# EAGLE board Index Registers - 1.0 (EAGLE 9.6.2), part 1 of 2
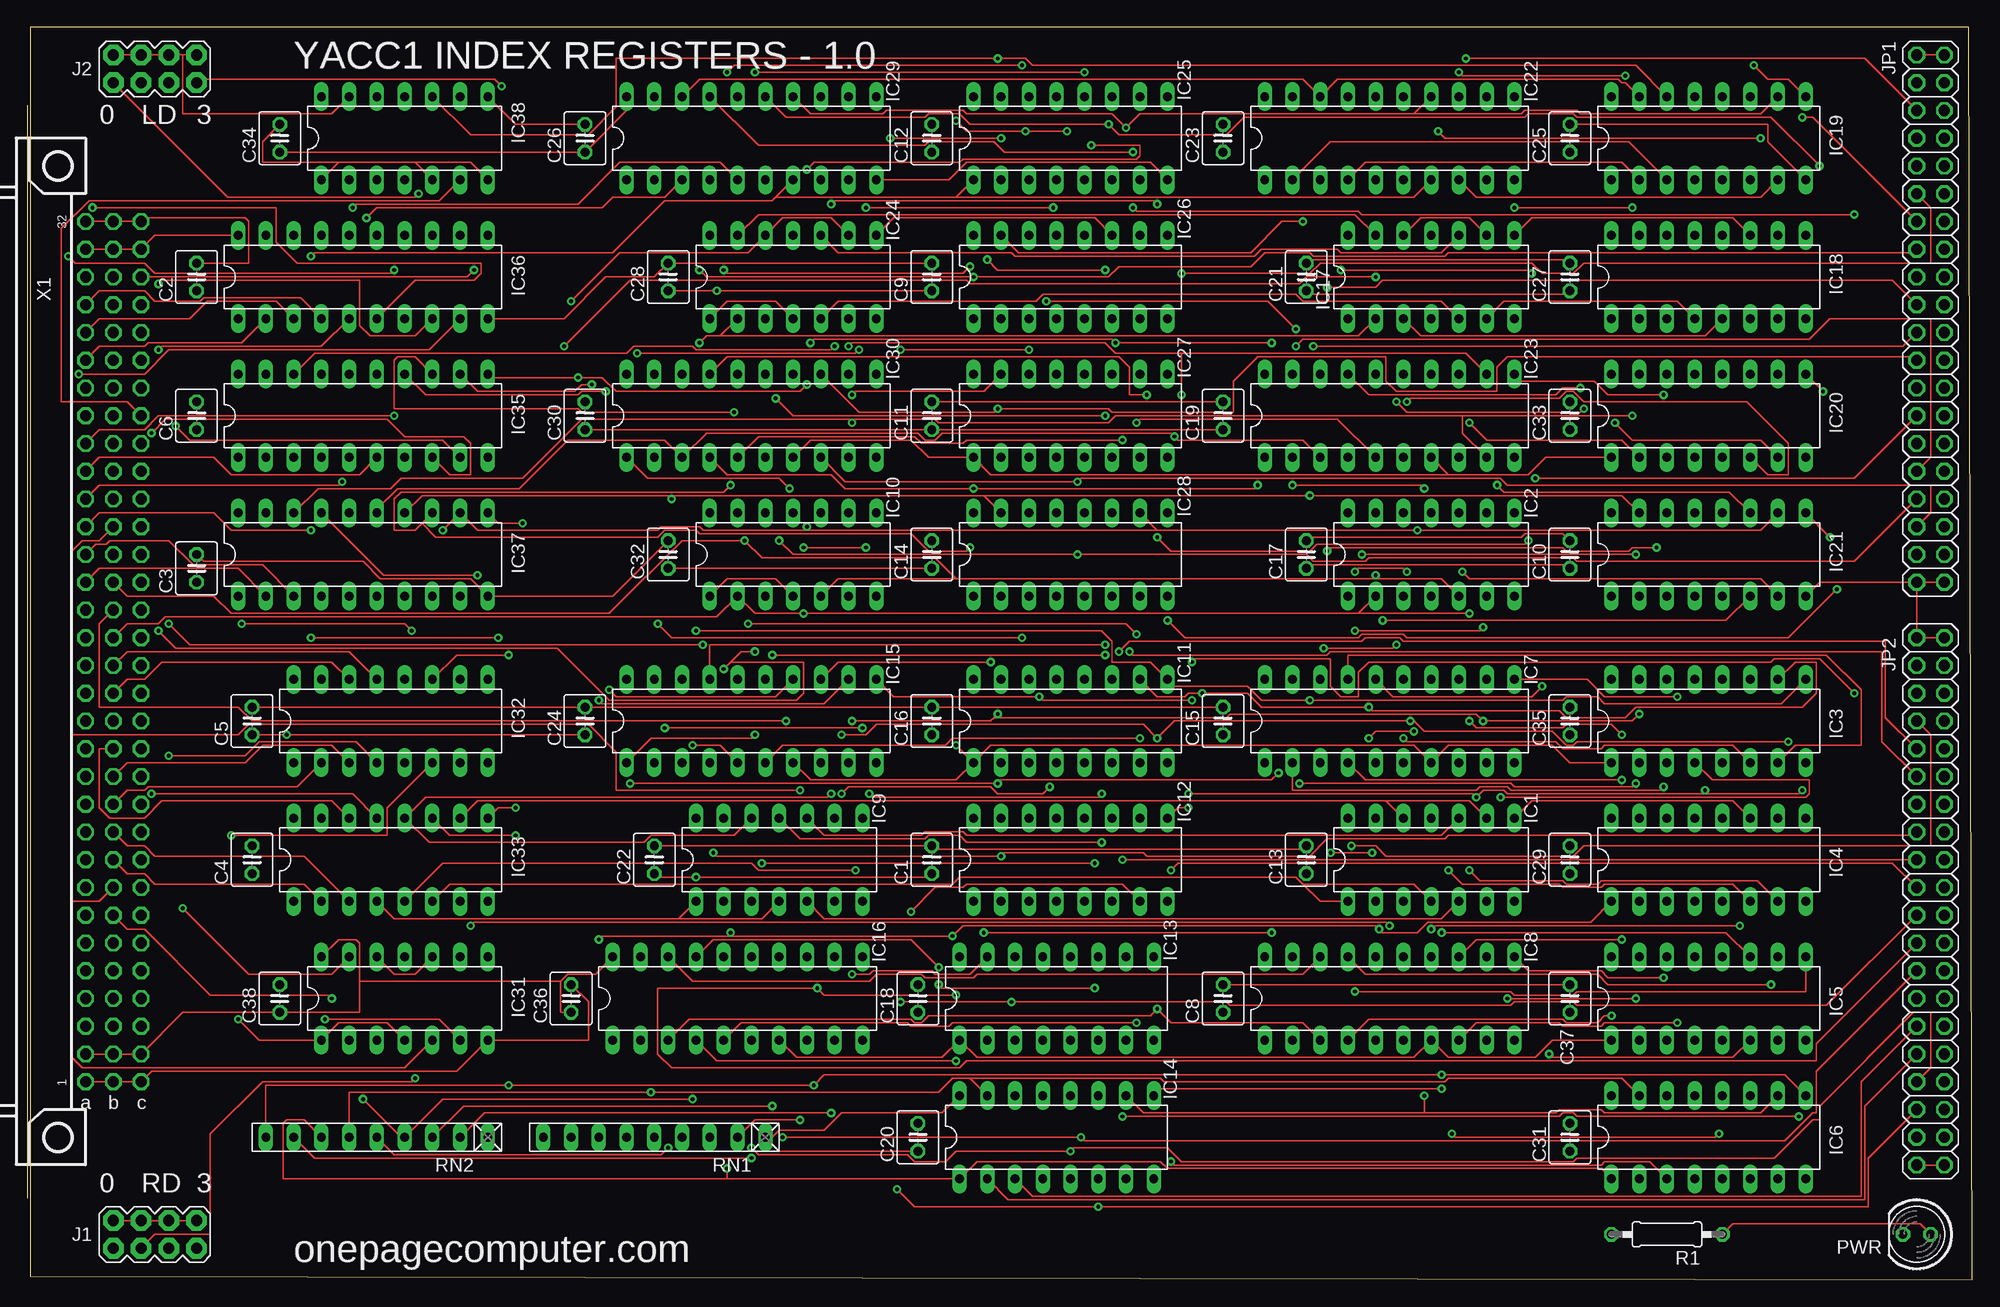
[diagram p9: board, top side]
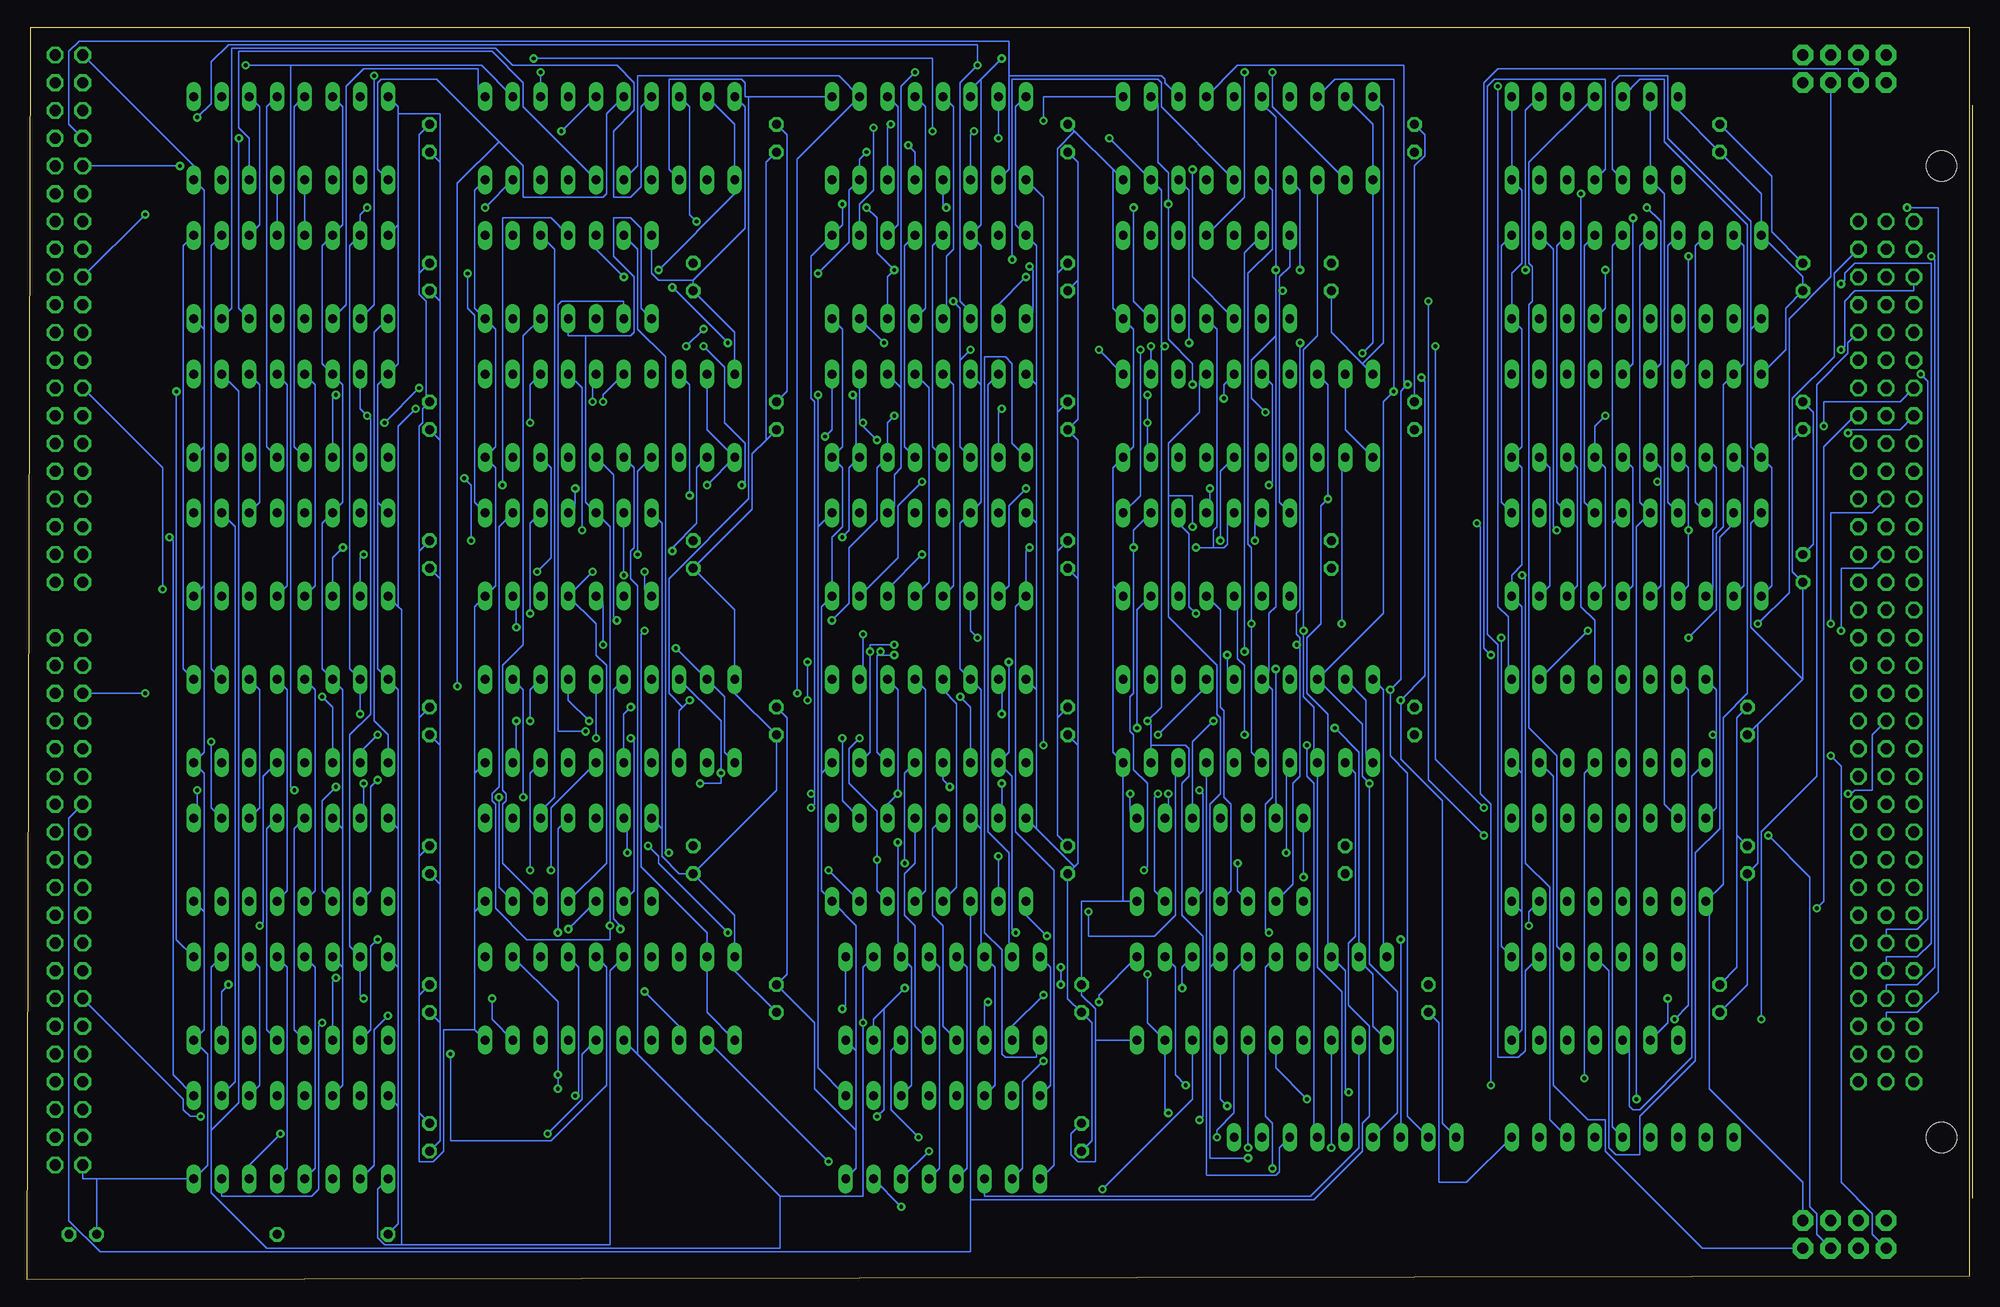
[diagram p10: board, bottom side, seen from below]

Size 177.8 x 114.62 mm. Coordinates in mm from the lower left corner, seen from the top.
Outline: 0,0.33 177.8,0 177.47,114.62 0,114.62 0,0.33
Copper layers (1*16): Top 0.035mm / dielectric 1.5mm / Bottom 0.035mm
Design rules "default": minimum track width 6mil, minimum drill 0.35mm, track to track 6mil, track to pad 6mil, pad to pad 6mil, via to via 6mil, smd to smd 6mil, copper to edge 40mil, drill to drill 6mil, minimum pad ring 10mil, minimum via ring 8mil, stop-mask expansion 4mil, vias tented up to drill 0mil, thermal gap 10mil

## Footprints (pad centres in the part's own frame; a part is rotated, then mirrored left to right if it is on the bottom)
C025-040X050 = drill 0.813 octagon: 1 -1.27,0; 2 1.27,0
DIL14 = drill 0.813 long: 1 -7.62,-3.81; 2 -5.08,-3.81; 3 -2.54,-3.81; 4 0,-3.81; 5 2.54,-3.81; 6 5.08,-3.81; 7 7.62,-3.81; 8 7.62,3.81; 9 5.08,3.81; 10 2.54,3.81; 11 0,3.81; 12 -2.54,3.81; 13 -5.08,3.81; 14 -7.62,3.81
DIL16 = drill 0.813 long: 1 -8.89,-3.81; 2 -6.35,-3.81; 3 -3.81,-3.81; 4 -1.27,-3.81; 5 1.27,-3.81; 6 3.81,-3.81; 7 6.35,-3.81; 8 8.89,-3.81; 9 8.89,3.81; 10 6.35,3.81; 11 3.81,3.81; 12 1.27,3.81; 13 -1.27,3.81; 14 -3.81,3.81; 15 -6.35,3.81; 16 -8.89,3.81
DIL20 = drill 0.813 long: 1 -11.43,-3.81; 2 -8.89,-3.81; 3 -6.35,-3.81; 4 -3.81,-3.81; 5 -1.27,-3.81; 6 1.27,-3.81; 7 3.81,-3.81; 8 6.35,-3.81; 9 8.89,-3.81; 10 11.43,-3.81; 11 11.43,3.81; 12 8.89,3.81; 13 6.35,3.81; 14 3.81,3.81; 15 1.27,3.81; 16 -1.27,3.81; 17 -3.81,3.81; 18 -6.35,3.81; 19 -8.89,3.81; 20 -11.43,3.81
2X4 = drill 1.016 pad 1.88 octagon: 1 -3.81,-1.27; 2 -3.81,1.27; 3 -1.27,-1.27; 4 -1.27,1.27; 5 1.27,-1.27; 6 1.27,1.27; 7 3.81,-1.27; 8 3.81,1.27
2X20 = drill 1.016 octagon: 1 -24.13,-1.27; 2 -24.13,1.27; 3 -21.59,-1.27; 4 -21.59,1.27; 5 -19.05,-1.27; 6 -19.05,1.27; 7 -16.51,-1.27; 8 -16.51,1.27; 9 -13.97,-1.27; 10 -13.97,1.27; 11 -11.43,-1.27; 12 -11.43,1.27; 13 -8.89,-1.27; 14 -8.89,1.27; 15 -6.35,-1.27; 16 -6.35,1.27; 17 -3.81,-1.27; 18 -3.81,1.27; 19 -1.27,-1.27; 20 -1.27,1.27; 21 1.27,-1.27; 22 1.27,1.27; 23 3.81,-1.27; 24 3.81,1.27; 25 6.35,-1.27; 26 6.35,1.27; 27 8.89,-1.27; 28 8.89,1.27; 29 11.43,-1.27; 30 11.43,1.27; 31 13.97,-1.27; 32 13.97,1.27; 33 16.51,-1.27; 34 16.51,1.27; 35 19.05,-1.27; 36 19.05,1.27; 37 21.59,-1.27; 38 21.59,1.27; 39 24.13,-1.27; 40 24.13,1.27
LED5MM = drill 0.813 octagon: A -1.27,0; K 1.27,0
0207/10 = drill 0.813 octagon: 1 -5.08,0; 2 5.08,0
RN-9 = drill 0.813 long: 1 -10.16,0; 2 -7.62,0; 3 -5.08,0; 4 -2.54,0; 5 0,0; 6 2.54,0; 7 5.08,0; 8 7.62,0; 9 10.16,0
FABC96R = drill 1.016 octagon: A1 -2.54,39.37; A2 -2.54,36.83; A3 -2.54,34.29; A4 -2.54,31.75; A5 -2.54,29.21; A6 -2.54,26.67; A7 -2.54,24.13; A8 -2.54,21.59; A9 -2.54,19.05; A10 -2.54,16.51; A11 -2.54,13.97; A12 -2.54,11.43; A13 -2.54,8.89; A14 -2.54,6.35; A15 -2.54,3.81; A16 -2.54,1.27; A17 -2.54,-1.27; A18 -2.54,-3.81; A19 -2.54,-6.35; A20 -2.54,-8.89; A21 -2.54,-11.43; A22 -2.54,-13.97; A23 -2.54,-16.51; A24 -2.54,-19.05; A25 -2.54,-21.59; A26 -2.54,-24.13; A27 -2.54,-26.67; A28 -2.54,-29.21; A29 -2.54,-31.75; A30 -2.54,-34.29; A31 -2.54,-36.83; A32 -2.54,-39.37; B1 -5.08,39.37; B2 -5.08,36.83; B3 -5.08,34.29; B4 -5.08,31.75; B5 -5.08,29.21; B6 -5.08,26.67; B7 -5.08,24.13; B8 -5.08,21.59; B9 -5.08,19.05; B10 -5.08,16.51; B11 -5.08,13.97; B12 -5.08,11.43; B13 -5.08,8.89; B14 -5.08,6.35; B15 -5.08,3.81; B16 -5.08,1.27; B17 -5.08,-1.27; B18 -5.08,-3.81; B19 -5.08,-6.35; B20 -5.08,-8.89; B21 -5.08,-11.43; B22 -5.08,-13.97; B23 -5.08,-16.51; B24 -5.08,-19.05; B25 -5.08,-21.59; B26 -5.08,-24.13; B27 -5.08,-26.67; B28 -5.08,-29.21; B29 -5.08,-31.75; B30 -5.08,-34.29; B31 -5.08,-36.83; B32 -5.08,-39.37; C1 -7.62,39.37; C2 -7.62,36.83; C3 -7.62,34.29; C4 -7.62,31.75; C5 -7.62,29.21; C6 -7.62,26.67; C7 -7.62,24.13; C8 -7.62,21.59; C9 -7.62,19.05; C10 -7.62,16.51; C11 -7.62,13.97; C12 -7.62,11.43; C13 -7.62,8.89; C14 -7.62,6.35; C15 -7.62,3.81; C16 -7.62,1.27; C17 -7.62,-1.27; C18 -7.62,-3.81; C19 -7.62,-6.35; C20 -7.62,-8.89; C21 -7.62,-11.43; C22 -7.62,-13.97; C23 -7.62,-16.51; C24 -7.62,-19.05; C25 -7.62,-21.59; C26 -7.62,-24.13; C27 -7.62,-26.67; C28 -7.62,-29.21; C29 -7.62,-31.75; C30 -7.62,-34.29; C31 -7.62,-36.83; C32 -7.62,-39.37 | hole 2.794: 0,-44.456; 0,44.456

## Placement (x,y rotation side)
C1  0.1  [C025-040X050]  82.55,38.43 90 top
C2  0.1  [C025-040X050]  15.24,91.77 90 top
C3  0.1  [C025-040X050]  15.24,65.1 90 top
C4  0.1  [C025-040X050]  20.32,38.43 90 top
C5  0.1  [C025-040X050]  20.32,51.13 90 top
C6  0.1  [C025-040X050]  15.24,79.07 90 top
C8  0.1  [C025-040X050]  109.22,25.73 90 top
C9  0.1  [C025-040X050]  82.55,91.77 90 top
C10  0.1  [C025-040X050]  140.97,66.37 90 top
C11  0.1  [C025-040X050]  82.55,79.07 90 top
C12  0.1  [C025-040X050]  82.55,104.47 90 top
C13  0.1  [C025-040X050]  116.84,38.43 90 top
C14  0.1  [C025-040X050]  82.55,66.37 90 top
C15  0.1  [C025-040X050]  109.22,51.13 90 top
C16  0.1  [C025-040X050]  82.55,51.13 90 top
C17  0.1  [C025-040X050]  116.84,66.37 90 top
C18  0.1  [C025-040X050]  81.28,25.73 90 top
C19  0.1  [C025-040X050]  109.22,79.07 90 top
C20  0.1  [C025-040X050]  81.28,13.03 90 top
C21  0.1  [C025-040X050]  116.84,91.77 90 top
C22  0.1  [C025-040X050]  57.15,38.43 90 top
C23  0.1  [C025-040X050]  109.22,104.47 90 top
C24  0.1  [C025-040X050]  50.8,51.13 90 top
C25  0.1  [C025-040X050]  140.97,104.47 90 top
C26  0.1  [C025-040X050]  50.8,104.47 90 top
C27  0.1  [C025-040X050]  140.97,91.77 90 top
C28  0.1  [C025-040X050]  58.42,91.77 90 top
C29  0.1  [C025-040X050]  140.97,38.43 90 top
C30  0.1  [C025-040X050]  50.8,79.07 90 top
C31  0.1  [C025-040X050]  140.97,13.03 90 top
C32  0.1  [C025-040X050]  58.42,66.37 90 top
C33  0.1  [C025-040X050]  140.97,79.07 90 top
C34  0.1  [C025-040X050]  22.86,104.47 90 top
C35  0.1  [C025-040X050]  140.97,51.13 90 top
C36  0.1  [C025-040X050]  49.53,25.73 90 top
C37  0.1  [C025-040X050]  140.97,25.73 90 top
C38  0.1  [C025-040X050]  22.86,25.73 90 top
IC1  74LS32N  [DIL14]  128.27,38.43 0 top
IC2  74LS32N  [DIL14]  128.27,66.37 0 top
IC3  74LS192N  [DIL16]  153.67,51.13 0 top
IC4  74LS192N  [DIL16]  153.67,38.43 0 top
IC5  74LS192N  [DIL16]  153.67,25.73 0 top
IC6  74LS192N  [DIL16]  153.67,13.03 0 top
IC7  74LS244N  [DIL20]  124.46,51.13 0 top
IC8  74LS244N  [DIL20]  124.46,25.73 0 top
IC9  74LS32N  [DIL14]  68.58,38.43 0 top
IC10  74LS32N  [DIL14]  69.85,66.37 0 top
IC11  74LS192N  [DIL16]  95.25,51.13 0 top
IC12  74LS192N  [DIL16]  95.25,38.43 0 top
IC13  74LS192N  [DIL16]  93.98,25.73 0 top
IC14  74LS192N  [DIL16]  93.98,13.03 0 top
IC15  74LS244N  [DIL20]  66.04,51.13 0 top
IC16  74LS244N  [DIL20]  64.77,25.73 0 top
IC17  74LS32N  [DIL14]  128.27,91.77 0 top
IC18  74LS192N  [DIL16]  153.67,91.77 0 top
IC19  74LS192N  [DIL16]  153.67,104.47 0 top
IC20  74LS192N  [DIL16]  153.67,79.07 0 top
IC21  74LS192N  [DIL16]  153.67,66.37 0 top
IC22  74LS244N  [DIL20]  124.46,104.47 0 top
IC23  74LS244N  [DIL20]  124.46,79.07 0 top
IC24  74LS32N  [DIL14]  69.85,91.77 0 top
IC25  74LS192N  [DIL16]  95.25,104.47 0 top
IC26  74LS192N  [DIL16]  95.25,91.77 0 top
IC27  74LS192N  [DIL16]  95.25,79.07 0 top
IC28  74LS192N  [DIL16]  95.25,66.37 0 top
IC29  74LS244N  [DIL20]  66.04,104.47 0 top
IC30  74LS244N  [DIL20]  66.04,79.07 0 top
IC31  74LS32N  [DIL14]  34.29,25.73 0 top
IC32  74LS139N  [DIL16]  33.02,51.13 0 top
IC33  74LS139N  [DIL16]  33.02,38.43 0 top
IC35  74LS245N  [DIL20]  30.48,79.07 0 top
IC36  74LS245N  [DIL20]  30.48,91.77 0 top
IC37  74LS245N  [DIL20]  30.48,66.37 0 top
IC38  74LS266N  [DIL14]  34.29,104.47 0 top
J1  [2X4]  11.43,4.14 0 top
J2  [2X4]  11.43,110.82 0 top
JP1  [2X20]  173.99,87.96 270 top
JP2  [2X20]  173.99,34.62 270 top
PWR  [LED5MM]  172.72,4.14 180 top
R1  330  [0207/10]  149.86,4.14 180 top
RN1  10k  [RN-9]  57.15,13.03 180 top
RN2  10k  [RN-9]  31.75,13.03 180 top
X1  FABC96R  [FABC96R]  2.54,57.48 180 top

## Tracks (layer width: path | path; a pad name or v marks a point on that pad's centre or on a via)
-BUS-EN  (via drill 0.35)
  Top 0.152: IC31.4 32.7,23.51 28.26,23.51 IC31.1 20.95,21.92 v19.05,23.82
  Bottom 0.152: X1.C28 11.11,85.74 11.11,84.78 13.97,81.93 13.97,46.05 19.05,40.97 v19.05,23.82
-HL-SWAP  (via drill 0.35)
  Top 0.152: IC31.13 27.62,27.95 20,27.95 v13.97,33.98 | IC38.6 37.47,98.75 5.4,98.75 2.86,96.22 2.86,80.34 8.89,80.34 X1.C25
  Bottom 0.152: v13.97,33.98 13.34,34.62 13.34,76.21 10.48,79.07 X1.C25
-LDSEL
  Top 0.152: J2.2 J2.4 J2.6 13.97,112.09 | 13.97,112.09 J2.8 | 13.97,112.09 13.97,106.69 27.62,106.69 IC38.13
  Bottom 0.152: IC33.15 27.94,43.51 27.94,99.39 IC38.2 IC38.13
-R0-LDSEL  (via drill 0.35)
  Top 0.152: IC9.12 64.45,40.65 56.83,40.65 56.2,40.02 36.51,40.02 IC33.12 36.2,44.14 73.03,44.14 v73.34,44.46
  Bottom 0.152: IC9.9 73.34,42.56 v73.34,44.46
-R0-RDSEL
  Top 0.152: IC10.1 63.82,64.15 68.26,64.15 IC10.4 | IC33.4 33.34,33.03 59.37,33.03 | IC9.1 59.37,33.03 | IC9.4 66.99,33.03 59.37,33.03
  Bottom 0.152: IC10.4 68.58,61.29 68.58,52.4 68.26,52.08 68.26,44.14 67.63,43.51 67.63,35.57 IC9.4
-R1-LDSEL  (via drill 0.35)
  Top 0.152: IC33.11 38.42,40.65 v44.45,40.65 | v49.53,89.55 53.98,93.99 65.72,93.99 IC24.12 68.9,97.17 73.34,97.17 IC24.9
  Bottom 0.152: v44.45,40.65 49.53,45.73 v49.53,89.55
-R1-RDSEL  (via drill 0.35)
  Top 0.152: IC24.1 63.82,89.55 68.26,89.55 IC24.4 | IC33.5 37.78,38.11 66.04,38.11 66.67,37.48 v75.56,37.48 | v76.52,67 v70.8,67
  Bottom 0.152: IC10.12 67.94,69.55 67.94,67.32 68.26,67 69.22,67 | 69.22,67 69.22,68.59 68.9,68.91 68.9,87.01 IC24.4 | v75.56,37.48 75.25,37.8 75.25,45.41 76.52,46.68 76.52,49.86 76.83,50.18 76.83,53.35 76.52,53.67 v76.52,67 76.52,68.59 IC10.9 | v70.8,67 69.22,67
-R2-LDSEL
  Top 0.152: IC33.10 40.96,43.83 124.14,43.83 | IC1.12 124.14,43.83 | IC1.9 131.76,43.83 124.14,43.83
-R2-RDSEL  (via drill 0.35)
  Top 0.152: v121.28,64.78 121.6,65.1 125.73,65.1 v126.05,64.78 | IC33.6 38.42,36.21 84.45,36.21 85.09,36.84 115.89,36.84 116.52,36.21 | 116.52,36.21 118.11,34.62 IC1.1 | IC1.4 126.68,36.21 116.52,36.21
  Bottom 0.152: IC2.1 121.28,63.2 v121.28,64.78 | v126.05,64.78 IC2.4 125.73,60.02 125.73,57.16 124.78,56.21 124.78,38.11 IC1.4
-R3-LDSEL  (via drill 0.35)
  Top 0.152: IC33.9 42.86,43.19 v44.45,43.19 | v48.9,85.42 54.93,91.45 85.72,91.45 86.04,91.14 116.2,91.14 116.84,91.77 v123.19,91.77 | IC17.9 131.76,97.17 127.32,97.17 IC17.12
  Bottom 0.152: v44.45,43.19 48.9,47.64 v48.9,85.42 | v123.19,91.77 125.73,94.31 IC17.12
-R3-RDSEL  (via drill 0.35)
  Top 0.152: v40.32,32.4 40.64,32.71 124.14,32.71 v124.46,32.4
  Bottom 0.152: IC17.1 121.6,88.91 121.6,96.22 122.56,97.17 124.14,97.17 124.14,93.67 122.24,91.77 122.24,86.69 122.56,86.37 126.68,86.37 | 126.68,86.37 128.27,86.37 IC17.4 | IC33.7 40.32,33.67 v40.32,32.4 | IC2.9 134.62,68.91 134.62,45.1 135.25,44.46 135.25,43.83 134.94,43.51 134.94,33.98 132.08,31.13 124.46,31.13 v124.46,32.4 124.46,68.91 IC2.12 126.68,71.13 126.68,86.37
-RDSEL
  Top 0.152: J1.2 J1.4 J1.6 J1.8
  Bottom 0.152: J1.8 15.24,8.9 23.81,17.47 23.81,34.3 IC33.1 22.54,36.21 22.54,51.45 20.32,53.67 20.32,96.53 27.94,104.15 27.94,109.87 30.16,109.87 IC38.12
-REG-DN  (via drill 0.35)
  Top 0.152: IC24.5 73.98,89.55 92.08,89.55 92.71,90.18 115.89,90.18 116.52,89.55 129.22,89.55 IC17.5 | IC9.5 72.71,33.03 129.22,33.03 IC1.5 | X1.B21 6.35,67.64 4.76,67.64 3.81,66.69 3.81,49.86 19.05,49.86 20,50.81 51.12,50.81 53.66,48.27 53.66,44.78 v70.48,44.78
  Bottom 0.152: v70.48,44.78 70.17,44.46 70.17,35.57 IC9.5 | IC17.5 132.4,86.37 132.4,58.11 134.3,56.21 134.3,44.78 133.99,44.46 133.99,43.83 134.3,43.51 134.3,38.11 IC1.5
-REG-FUNC-LD
  Top 0.152: IC31.5 34.29,19.38 4.76,19.38 3.81,20.33 3.81,34.62 6.35,34.62 X1.B8
-REG-FUNC-RD  (via drill 0.35)
  Top 0.152: v27.62,25.73 27.3,26.05 16.51,26.05 10.48,32.08 8.89,32.08 X1.B7
  Bottom 0.152: IC31.2 27.62,23.51 v27.62,25.73
-REG-LD-HI  (via drill 0.35)
  Top 0.152: v119.06,39.06 v122.87,39.06 | 64.14,56.53 65.09,57.48 v66.36,57.48 | 64.14,56.53 v63.5,55.89 | v11.75,59.38 13.34,57.8 48.26,57.8 53.02,53.03 70.17,53.03 70.8,53.67 70.8,56.53 64.14,56.53 | IC17.13 121.28,97.48 66.67,97.48 IC24.13
  Bottom 0.152: IC1.13 122.87,41.92 v122.87,39.06 | v119.06,39.06 119.38,39.38 119.38,84.47 121.92,87.01 121.92,94.31 IC17.13 | v63.5,55.89 IC9.13 | v66.36,57.48 66.36,93.99 IC24.13 | X1.B20 8.89,65.1 11.75,65.1 v11.75,59.38
-REG-LD-LO  (via drill 0.35)
  Top 0.152: IC24.10 73.98,93.99 89.85,93.99 90.17,93.67 112.08,93.67 112.71,94.31 119.7,94.31 120.02,93.99 129.22,93.99 IC17.10 | IC9.10 72.71,40.65 81.6,40.65 81.92,40.97 85.41,40.97 85.72,40.65 129.22,40.65 IC1.10 | X1.B18 6.35,60.02 6.35,52.4 19.05,52.4 20.32,51.13 v69.22,51.13
  Bottom 0.152: v69.22,51.13 71.12,49.23 IC9.10 | IC17.10 129.54,94.31 129.54,44.14 130.81,42.88 IC1.10
-REG-RD-HI  (via drill 0.35)
  Top 0.152: IC10.5 73.98,64.15 84.77,64.15 | 123.19,64.15 129.22,64.15 IC2.5 | 123.19,64.15 84.77,64.15 | 84.77,64.15 82.87,66.05 66.99,66.05 v65.41,67.64 59.69,67.64 53.02,60.97 18.41,60.97 16.83,62.56 8.89,62.56 X1.B19 | 123.19,64.15 v123.19,64.47
  Bottom 0.152: IC10.13 65.41,69.55 v65.41,67.64 | v123.19,64.47 IC2.13
-REG-RD-LO  (via drill 0.35)
  Top 0.152: 121.6,60.97 IC2.2 | 121.6,60.97 v70.8,60.97 66.36,60.97 IC10.2 62.87,60.66 12.38,60.66 11.75,60.02 8.89,60.02 X1.B17 | 121.6,60.97 v131.76,60.97
  Bottom 0.152: v70.8,60.97 71.44,61.61 71.44,68.27 72.39,69.23 IC10.10 | IC2.10 131.76,69.23 v131.76,60.97
-REG-UP  (via drill 0.35)
  Top 0.152: v122.56,49.54 123.19,50.18 v126.68,50.18 | v61.28,85.74 61.91,86.37 63.18,86.37 | IC24.2 63.18,86.37 | v12.7,60.02 14.61,58.11 v61.59,58.11 | IC17.2 121.6,86.37 63.18,86.37
  Bottom 0.152: IC1.2 122.24,35.57 122.24,49.23 v122.56,49.54 | v126.68,50.18 129.22,50.18 129.22,89.23 128.91,89.55 123.19,89.55 IC17.2 | IC9.2 61.91,36.21 61.91,45.41 61.28,46.05 61.28,58.11 | 61.28,58.11 61.28,58.75 61.59,59.07 61.59,60.97 61.28,61.29 v61.28,85.74 | X1.B22 8.89,70.18 12.7,70.18 v12.7,60.02 | 61.28,58.11 v61.59,58.11
-RESET  (via drill 0.35)
  Top 0.152: v40.64,92.41 40.01,91.77 X1.C30
  Bottom 0.152: IC38.9 40.64,107.01 v40.64,92.41
-RLD0  (via drill 0.35)
  Top 0.152: v35.56,99.39 35.24,99.07 18.1,99.07 J2.1
  Bottom 0.152: IC32.12 34.29,60.34 35.56,61.61 v35.56,99.39
-RRD0  (via drill 0.35)
  Top 0.152: IC32.4 29.84,49.23 20.95,49.23 19.68,47.95 v12.7,47.95
  Bottom 0.152: v12.7,47.95 11.75,47 11.75,8.9 8.89,6.04 8.89,4.14 J1.1
ADATA0  (via drill 0.35)
  Top 0.152: IC35.18 26.04,84.78 54.61,84.78 55.24,85.42 60.64,85.42 60.96,85.1 73.34,85.1 v73.66,85.42 | v78.74,104.47 v88.9,104.47 | v146.69,98.12 v135.89,98.12 | RN1.2 66.36,14.62 v70.48,14.62 | 88.27,51.45 87.95,51.13 v75.25,51.13 | 88.27,51.45 v88.58,51.77 | 88.27,51.45 109.54,51.45 109.86,51.77 132.4,51.77 v133.03,51.13 146.69,51.13 v147.32,51.77
  Bottom 0.152: v88.9,104.47 IC25.15 | v78.74,104.47 IC29.9 73.98,99.71 73.98,85.74 v73.66,85.42 73.98,85.1 73.98,52.4 v75.25,51.13 74.93,50.81 74.93,48.91 | v135.89,98.12 IC22.9 | v146.69,98.12 147.32,97.48 IC18.15 148.27,94.63 148.27,55.89 IC3.15 v147.32,51.77 | v70.48,14.62 70.17,14.94 70.17,31.44 72.07,33.35 72.07,45.41 71.44,46.05 71.44,48.59 71.75,48.91 74.93,48.91 | IC15.9 74.93,48.91 | IC11.15 88.58,54.62 v88.58,51.77 | IC7.9 133.03,47.64 v133.03,51.13
ADATA1  (via drill 0.35)
  Top 0.152: v25.72,93.67 26.04,93.99 53.34,93.99 58.1,98.75 67.94,98.75 68.26,99.07 | IC29.7 68.26,99.07 | 84.77,99.07 IC25.1 | 68.26,99.07 84.77,99.07 | IC22.7 126.68,99.07 84.77,99.07 | IC3.1 140.97,47.32 139.38,48.91 129.86,48.91 IC7.7 126.68,48.91 87.95,48.91 IC11.1 | IC11.1 84.77,45.73 71.44,45.73 IC15.7 | IC11.1 v84.77,48.91
  Bottom 0.152: IC35.17 25.72,83.83 v25.72,93.67 | IC18.1 146.05,86.69 146.05,51.13 144.78,49.86 IC3.1 | RN1.3 63.18,12.08 63.18,9.86 63.5,9.54 69.85,9.54 IC15.7 | IC25.1 84.77,99.07 v84.77,48.91
ADATA2  (via drill 0.35)
  Top 0.152: IC11.10 103.19,53.35 105.73,53.35 106.05,53.67 v107.31,53.67 111.44,53.67 112.71,52.4 v122.56,52.4 122.87,52.08 140.02,52.08 140.65,51.45 146.05,51.45 147,52.4 162.24,52.4 163.51,53.67 163.51,56.53 161.61,56.53 IC3.10 | v60.64,48.91 63.18,48.91 IC15.5 | v29.53,98.12 29.84,98.44 50.16,98.44 53.98,102.25 63.18,102.25 IC29.5 | v101.28,59.07 100.33,60.02 v65.72,60.02
  Bottom 0.152: IC22.5 121.92,101.93 121.92,110.19 103.5,110.19 IC25.10 107.31,102.56 v107.31,53.67 | v122.56,52.4 123.19,51.77 IC7.5 | IC3.10 160.97,55.89 160.97,94.63 IC18.10 | RN1.4 60.01,13.35 60.01,45.41 60.64,46.05 v60.64,48.91 | IC35.16 28.26,83.83 28.26,96.85 v29.53,98.12 | IC15.5 65.72,48.27 v65.72,60.02 65.72,67 66.04,67.32 66.04,92.09 63.82,94.31 63.82,99.71 IC29.5 | IC11.10 101.28,55.26 v101.28,59.07
ADATA3  (via drill 0.35)
  Top 0.152: v30.8,97.17 31.75,98.12 52.39,98.12 53.34,99.07 58.1,99.07 IC29.3 | IC3.9 160.34,52.72 144.15,52.72 143.51,53.35 140.65,53.35 140.34,53.03 v117.16,53.03 112.71,53.03 111.44,54.3 104.78,54.3 IC11.9 102.55,56.53 99.06,56.53 99.06,58.43 98.11,59.38 v60.96,59.38
  Bottom 0.152: RN1.5 57.47,13.35 57.47,26.36 59.69,28.59 IC15.3 60.01,47.64 60.01,52.4 60.96,53.35 v60.96,59.38 60.96,85.1 59.69,86.37 IC29.3 | IC35.15 30.8,83.83 v30.8,97.17 | 111.76,108.28 112.08,108.28 112.08,109.55 112.39,109.87 119.06,109.87 119.06,101.61 IC22.3 | 111.76,108.28 IC25.9 | 117.79,52.4 118.11,52.08 IC7.3 | 117.79,52.4 v117.16,53.03 | IC3.9 163.51,55.89 163.51,94.63 IC18.9 | 111.76,108.28 111.76,71.45 119.06,64.15 119.06,53.67 117.79,52.4
ADATA4  (via drill 0.35)
  Top 0.152: IC26.15 90.49,93.99 111.76,93.99 114.62,96.85 v116.52,96.85 | IC19.15 146.05,109.55 145.73,109.55 145.41,109.87 119.7,109.87 IC22.18 116.52,109.87 61.28,109.87 IC29.18 | v54.93,45.41 v88.58,45.41 88.9,45.73 113.67,45.73 v114.3,46.37 | IC35.14 36.2,80.97 50.16,80.97 50.48,81.29 v52.7,81.29 | v147,45.41 146.69,45.1 135.89,45.1 135.57,45.41 v116.2,45.41
  Bottom 0.152: v116.52,96.85 117.16,97.48 117.16,107.33 IC22.18 | RN1.6 52.39,15.25 52.39,26.36 54.93,28.9 v54.93,45.41 55.56,46.05 55.56,50.81 IC15.18 53.66,60.97 53.66,80.34 v52.7,81.29 52.7,109.87 58.1,109.87 IC29.18 | IC12.15 88.58,42.56 v88.58,45.41 | IC7.18 114.3,51.13 v114.3,46.37 114.3,45.41 v116.2,45.41 | IC4.15 147,42.56 v147,45.41
ADATA5  (via drill 0.35)
  Top 0.152: IC35.13 35.24,84.47 33.66,84.47 33.34,84.15 33.34,79.7 50.16,79.7 50.48,79.39 v64.45,79.39 | v86.04,92.72 85.41,92.09 63.82,92.09 v63.5,92.41 | v52.07,31.13 52.39,31.44 64.14,31.44 | 64.14,31.44 v84.45,31.44 85.41,32.4 123.19,32.4 v123.51,32.08 123.83,31.76 127,31.76 127.95,32.71 142.88,32.71 IC4.1 | v138.43,54.3 137.48,53.35 124.78,53.35 IC7.16 | 64.14,31.44 v64.14,31.76
  Bottom 0.152: 63.5,86.37 v63.5,92.41 63.5,106.38 64.77,107.64 IC29.16 | 63.5,86.37 63.5,61.61 64.14,60.97 64.14,55.57 IC15.16 63.82,53.99 63.82,44.14 64.45,43.51 64.45,32.08 v64.14,31.76 | v64.45,79.39 65.72,80.66 65.72,84.15 63.5,86.37 | IC26.1 85.72,88.59 85.72,92.41 v86.04,92.72 | v52.07,31.13 RN1.7 | v84.45,31.44 86.36,33.35 IC12.1 | IC22.16 124.78,106.69 124.78,99.39 125.09,99.07 132.4,99.07 132.4,101.93 134.62,104.15 | 134.62,104.15 140.34,109.87 145.41,109.87 145.73,109.55 145.73,101.61 IC19.1 | IC7.16 124.14,53.99 124.14,33.03 123.51,32.4 v123.51,32.08 | 134.62,104.15 138.43,100.34 v138.43,54.3
ADATA6  (via drill 0.35)
  Top 0.152: 126.68,106.69 101.6,106.69 v100.33,105.42 99.06,106.69 85.72,106.69 85.41,107.01 78.42,107.01 78.11,106.69 71.44,106.69 IC29.14 | IC22.14 126.68,106.69 | IC19.10 158.43,106.69 141.92,106.69 141.6,107.01 136.84,107.01 136.53,106.69 126.68,106.69 | v160.97,49.23 141.6,49.23 141.29,48.91 140.65,48.91 139.38,50.18 127.64,50.18 126.68,51.13 v126.36,51.13 104.78,51.13 v103.19,49.54 101.92,50.81 77.47,50.81 76.52,49.86 v74.3,49.86 | v53.02,53.99 53.66,53.35 68.26,53.35 IC15.14 | IC35.12 40.96,81.29 49.85,81.29 50.48,81.93 v51.44,81.93
  Bottom 0.152: IC26.10 101.6,98.44 100.33,99.71 v100.33,105.42 | IC12.10 103.19,43.83 v103.19,49.54 | v126.36,51.13 128.27,53.03 IC7.14 | IC4.10 160.97,43.19 v160.97,49.23 | RN1.8 51.44,14.94 51.44,46.37 53.02,47.95 v53.02,53.99 52.07,54.94 52.07,81.29 51.75,81.61 | 51.75,81.61 v51.44,81.93 | IC29.14 66.99,111.14 51.75,111.14 51.75,81.61 | v74.3,49.86 69.85,54.3 IC15.14
ADATA7  (via drill 0.35)
  Top 0.152: v157.8,111.14 159.07,109.87 160.97,109.87 IC19.9 | IC12.9 105.09,43.19 v106.05,43.19 | v106.05,44.46 132.08,44.46 v132.4,44.14 133.03,44.78 134.94,44.78 135.25,44.46 153.35,44.46 | v162.24,44.78 161.93,44.46 153.35,44.46 | 153.35,44.46 v153.35,44.78 | v52.07,53.03 52.39,52.72 72.71,52.72 IC15.12 | IC35.11 42.23,82.56 v50.16,82.56 52.39,82.56 53.66,81.29 70.48,81.29 v71.12,81.93 | v103.19,98.44 102.87,98.75 73.66,98.75 v73.34,98.44
  Bottom 0.152: IC22.12 136.21,111.14 153.67,111.14 | v157.8,111.14 153.67,111.14 | v106.05,43.19 105.73,43.51 105.73,44.46 | 105.73,44.46 105.73,80.34 106.05,80.66 106.05,93.67 IC26.9 103.19,96.53 v103.19,98.44 | IC7.12 132.4,53.99 v132.4,44.14 | 105.73,44.46 v106.05,44.46 | IC4.9 162.24,42.56 v162.24,44.78 | 153.67,111.14 153.67,45.1 v153.35,44.78 | RN1.9 48.26,14.3 48.26,43.83 52.07,47.64 v52.07,53.03 49.85,55.26 49.85,82.25 v50.16,82.56 | IC29.12 74.3,107.64 74.3,102.25 73.34,101.3 v73.34,98.44 73.34,86.05 71.12,83.83 v71.12,81.93
ADATA8  (via drill 0.35)
  Top 0.152: v147,25.73 v135.25,25.73 | IC23.9 131.13,77.48 131.13,79.07 | v146.69,79.07 131.13,79.07 | RN2.2 41.59,15.25 v73.34,15.25 | v75.25,80.97 75.56,81.29 87.31,81.29 IC27.15 | IC37.18 26.35,72.4 33.02,72.4 33.97,73.36 45.09,73.36 50.48,78.75 74.93,78.75 | v75.25,78.44 74.93,78.75 | v75.25,27.95 76.83,27.95 77.15,28.27 82.55,28.27 82.87,27.95 86.04,27.95 IC13.15 | 131.13,79.07 99.38,79.07 98.74,78.44 83.19,78.44 82.87,78.75 74.93,78.75
  Bottom 0.152: IC8.9 135.25,23.82 v135.25,25.73 | v147,25.73 147.32,26.05 IC5.15 148.27,30.49 148.27,49.86 146.37,51.77 146.37,78.75 v146.69,79.07 147.32,79.7 IC20.15 | v73.34,15.25 73.66,15.57 IC16.9 75.25,23.51 v75.25,27.95 | IC37.18 25.08,71.13 25.08,94.63 IC36.18 | IC13.15 87.95,29.86 87.95,39.06 89.85,40.97 89.85,81.93 IC27.15 | IC30.9 75.25,75.58 v75.25,78.44 v75.25,80.97
ADATA9  (via drill 0.35)
  Top 0.152: IC30.7 71.44,76.85 80.64,76.85 82.23,75.26 IC27.1 87.95,73.67 129.86,73.67 | 129.86,73.67 IC23.7 | 129.86,73.67 137.16,73.67 138.75,75.26 IC20.1 | IC5.1 139.38,21.92 137.79,20.33 129.86,20.33 IC8.7 126.68,20.33 86.68,20.33 IC13.1 83.5,20.33 70.17,20.33 IC16.7 | RN2.3 39.69,15.89 v67.94,15.89 | IC37.17 32.38,64.47 v40.96,64.47
  Bottom 0.152: IC37.17 27.62,71.13 27.62,94.63 IC36.17 | v67.94,15.89 68.58,16.52 IC16.7 | v40.96,64.47 40.64,64.15 40.64,38.11 38.42,35.89 38.42,14.62 RN2.3 | IC27.1 87.63,76.53 87.63,83.83 88.27,84.47 90.17,84.47 90.17,31.76 88.58,30.17 88.58,20.65 88.27,20.33 85.41,20.33 85.41,21.6 IC13.1
ADATA10  (via drill 0.35)
  Top 0.152: v60.64,16.52 37.78,16.52 RN2.4 33.97,13.03 v30.48,16.52 | IC30.5 66.67,77.16 80.96,77.16 81.6,76.53 85.41,76.53 85.72,76.85 v100.01,76.85 | IC23.5 119.7,78.75 101.6,78.75 v101.28,78.44 | IC16.5 65.09,23.51 80.33,23.51 80.64,23.19 84.14,23.19 84.45,23.51 v101.28,23.51
  Bottom 0.152: IC36.16 30.16,94.63 30.16,71.13 IC37.16 30.48,68.91 v30.48,16.52 | v60.64,16.52 63.5,19.38 IC16.5 | 101.6,78.44 v100.01,76.85 | IC27.10 101.6,78.44 | 101.6,78.44 v101.28,78.44 | 108.9,7.63 121.92,20.65 | 121.92,20.65 IC8.5 | 108.9,7.63 101.28,7.63 v101.28,23.51 101.28,28.59 IC13.10 | IC5.10 160.97,28.59 160.97,13.67 | 160.97,13.67 160.97,7.95 155.89,2.87 108.9,2.87 108.9,7.63 | IC20.10 158.43,81.29 158.43,16.2 160.97,13.67 | IC23.5 122.24,74.31 122.24,67 122.56,66.69 122.56,64.15 121.92,63.51 121.92,20.65
ADATA11  (via drill 0.35)
  Top 0.152: IC20.9 v164.15,81.29 | IC8.3 116.52,23.51 104.46,23.51 v103.19,24.78 102.55,24.14 82.23,24.14 81.6,23.51 80.96,23.51 80.64,23.82 60.33,23.82 IC16.3 | IC23.3 116.52,76.85 105.09,76.85 v104.78,77.16 104.46,77.48 83.5,77.48 82.87,76.85 81.92,76.85 81.28,77.48 61.91,77.48 IC30.3 58.1,76.85 49.21,76.85 44.77,72.4 33.66,72.4 31.75,70.5 IC37.15 | v58.42,12.08 57.78,11.44 33.34,11.44 RN2.5 | IC5.9 162.56,26.36 141.6,26.36 141.29,26.05 135.89,26.05 135.57,26.36 v121.28,26.36
  Bottom 0.152: IC5.9 164.15,31.13 v164.15,81.29 | v103.19,24.78 102.87,25.09 IC13.9 | v104.78,77.16 104.14,77.8 IC27.9 | RN2.5 32.7,13.98 32.7,69.23 | IC37.15 32.7,69.23 | v58.42,12.08 IC16.3 | IC36.15 32.7,94.63 32.7,69.23 | v121.28,26.36 118.11,23.19 IC8.3
ADATA12  (via drill 0.35)
  Top 0.152: RN2.6 29.21,17.16 v56.83,17.16 83.19,17.16 84.45,18.43 86.04,18.43 | IC14.15 86.04,18.43 | IC8.18 116.52,27.95 86.68,27.95 86.36,27.63 81.92,27.63 81.6,27.95 77.47,27.95 76.83,27.32 60.64,27.32 IC16.18 | IC6.15 145.73,18.43 129.86,18.43 129.54,18.11 103.82,18.11 103.5,18.43 86.04,18.43 | 87.31,71.77 IC28.15 | 58.74,71.77 35.88,71.77 IC37.14 | 58.74,71.77 87.31,71.77 | IC21.15 145.73,71.77 v117.16,71.77 87.31,71.77 | 58.74,71.77 v58.74,71.45
  Bottom 0.152: v56.83,17.16 57.15,17.47 57.15,28.27 IC16.18 58.74,29.86 58.74,51.77 60.64,53.67 60.64,58.75 59.37,60.02 59.37,70.81 v58.74,71.45 58.74,81.93 IC30.18 | IC37.14 35.24,71.13 35.24,94.63 IC36.14 | IC23.18 117.16,81.93 v117.16,71.77
ADATA13  (via drill 0.35)
  Top 0.152: v125.09,80.34 126.05,79.39 141.92,79.39 v142.24,79.7 | v64.14,72.72 63.5,72.08 33.97,72.08 33.34,71.45 33.34,68.59 35.24,68.59 35.88,69.23 | IC37.13 35.88,69.23 | RN2.7 25.08,14.62 23.5,14.62 23.18,14.3 23.18,9.22 63.82,9.22 | 63.82,9.22 IC14.1 86.68,10.81 103.5,10.81 104.14,10.17 143.83,10.17 IC6.1 | 63.82,9.22 v63.82,10.17 | 35.88,69.23 37.15,67.96 57.47,67.96 58.1,68.59 60.96,68.59 61.28,68.27 80.64,68.27 82.23,66.69 85.72,66.69 v86.04,67
  Bottom 0.152: IC6.1 145.73,8.27 145.73,3.82 145.1,3.19 143.51,3.19 | 143.51,3.19 124.46,3.19 124.46,28.27 IC8.16 | 143.83,61.61 143.51,61.29 143.51,3.19 | 143.83,61.61 IC21.1 | IC23.16 125.09,80.97 v125.09,80.34 | v142.24,79.7 143.83,78.12 143.83,61.61 | IC37.13 37.78,71.13 37.78,94.63 IC36.13 | IC30.16 63.82,81.93 63.82,73.04 v64.14,72.72 | IC14.1 83.82,10.49 83.82,37.48 87.31,40.97 87.31,61.61 IC28.1 86.36,66.69 v86.04,67 | IC16.16 64.45,28.59 64.45,14.94 63.82,14.3 v63.82,10.17
ADATA14  (via drill 0.35)
  Top 0.152: RN2.8 26.04,11.12 v66.04,11.12 | IC14.10 101.92,15.25 127.64,15.25 | 127.64,15.25 139.7,15.25 140.02,15.57 143.83,15.57 144.15,15.25 158.43,15.25 IC6.10 | 127.64,15.25 v127.64,16.84 | v37.78,68.59 IC37.12 40.96,68.59 57.47,68.59 57.78,68.91 61.28,68.91 61.59,68.59 71.12,68.59 | 103.19,68.59 IC28.10 | 103.19,68.59 v127,68.59 158.43,68.59 IC21.10 | 103.19,68.59 71.12,68.59 | 71.12,68.59 v71.12,68.91
  Bottom 0.152: v66.04,11.12 69.53,11.12 69.53,28.59 | IC16.14 69.53,28.59 | IC30.14 70.48,82.25 70.48,79.39 73.34,76.53 73.34,71.77 | 73.34,71.77 73.34,60.66 68.9,56.21 68.9,51.77 68.58,51.45 68.58,44.46 69.53,43.51 69.53,28.59 | IC8.14 127.32,28.59 127.32,17.16 v127.64,16.84 | v37.78,68.59 38.1,68.91 38.1,94.31 IC36.12 | IC23.14 127,81.61 v127,68.59 | IC6.10 158.75,18.11 158.75,68.91 IC21.10 | 73.34,71.77 71.12,71.77 v71.12,68.91
ADATA15  (via drill 0.35)
  Top 0.152: RN2.9 21.59,17.79 v43.81,17.79 v71.75,17.79 72.71,18.74 v129.22,18.74 160.66,18.74 IC6.9 | IC37.11 42.86,69.23 v45.09,69.23 | v74.93,85.42 75.25,85.74 98.42,85.74 99.38,84.78 105.41,84.78 | 105.41,84.78 131.44,84.78 IC23.12 | v129.22,17.47 103.5,17.47 IC14.9 | v164.78,67.96 IC21.9 | v105.41,80.97 105.41,84.78
  Bottom 0.152: IC37.11 42.86,71.13 42.86,94.63 IC36.11 | v71.75,17.79 72.71,18.74 72.71,28.59 IC16.12 | v45.09,69.23 44.77,68.91 44.77,44.46 43.81,43.51 v43.81,17.79 | v74.93,85.42 IC30.12 | IC14.9 105.41,19.38 105.41,68.91 | IC28.9 105.41,68.91 | IC8.12 129.22,25.41 v129.22,18.74 v129.22,17.47 | v164.78,67.96 164.47,67.64 164.47,18.74 IC6.9 | 105.41,68.91 v105.41,80.97
BUS-DIR
  Bottom 0.152: IC37.1 18.1,63.51 18.1,74.31 IC35.1 20,76.21 20,87.01 | 20,87.01 IC36.1 | IC38.3 32.7,101.61 32.7,109.55 32.07,110.19 27.62,110.19 27.62,104.47 20,96.85 20,87.01
DATA0
  Top 0.152: X1.A19 6.35,65.1 19.05,65.1 IC37.2
  Bottom 0.152: IC37.2 20.64,63.51 20.64,74.31 IC35.2
DATA1
  Top 0.152: X1.A20 6.03,67.32 6.99,67.32 7.3,67.64 12.7,67.64 14.92,65.42 21.27,65.42 IC37.3
  Bottom 0.152: IC37.3 23.5,63.2 23.5,68.59 23.18,68.91 23.18,74.31 IC35.3
DATA2  (via drill 0.35)
  Top 0.152: X1.A21 6.35,70.18 16.83,70.18 18.41,68.59 v25.72,68.59
  Bottom 0.152: IC37.4 25.72,63.51 v25.72,68.59 25.72,74.31 IC35.4
DATA3  (via drill 0.35)
  Top 0.152: X1.A22 6.35,72.72 28.26,72.72 v28.57,73.04
  Bottom 0.152: IC37.5 28.26,63.51 28.26,73.04 | 28.26,73.04 28.26,74.31 IC35.5 | 28.26,73.04 v28.57,73.04
DATA4
  Top 0.152: X1.A23 6.35,75.26 16.83,75.26 18.41,73.67 30.16,73.67 IC35.6
  Bottom 0.152: IC37.6 30.8,63.51 30.8,74.31 IC35.6
DATA5  (via drill 0.35)
  Top 0.152: X1.A24 6.35,77.8 10.48,77.8 11.75,79.07 v33.34,79.07
  Bottom 0.152: IC37.7 33.34,63.51 33.34,74.31 IC35.7 34.29,78.12 v33.34,79.07
DATA6  (via drill 0.35)
  Top 0.152: v11.11,77.48 12.38,78.75 32.7,78.75 34.29,77.16 39.69,77.16 40.32,76.53 40.32,73.67 38.42,73.67 IC35.8
  Bottom 0.152: IC37.8 35.88,63.51 35.88,74.31 IC35.8 | X1.A25 6.35,77.8 11.11,77.8 v11.11,77.48
DATA7  (via drill 0.35)
  Top 0.152: v13.34,78.12 14.61,76.85 37.78,76.85 IC35.9
  Bottom 0.152: IC37.9 38.42,63.51 38.42,74.31 IC35.9 | X1.A26 6.35,80.34 13.34,80.34 v13.34,78.12
DATA8
  Top 0.152: IC36.2 19.37,85.74 10.79,85.74 10.48,85.42 6.35,85.42 X1.A27
DATA9
  Top 0.152: IC36.3 22.54,89.55 16.19,89.55 14.61,87.96 6.35,87.96 X1.A28
DATA10
  Top 0.152: IC36.4 24.77,89.86 15.88,89.86 15.56,89.55 11.43,89.55 10.48,90.5 6.35,90.5 X1.A29
DATA11  (via drill 0.35)
  Top 0.152: IC36.5 26.67,85.42 12.06,85.42 v11.75,85.1
  Bottom 0.152: v11.75,85.1 11.43,85.42 11.43,89.55 10.48,90.5 5.08,90.5 X1.A30
DATA12  (via drill 0.35)
  Top 0.152: IC36.6 35.24,91.45 40.64,91.45 41.27,92.09 41.27,93.04 24.45,93.04 22.54,94.94 22.54,98.12 v5.71,98.12
  Bottom 0.152: v5.71,98.12 2.86,98.12 2.86,26.36 4.76,24.46 7.62,24.46 X1.B3
DATA13  (via drill 0.35)
  Top 0.152: v33.34,92.41 33.02,92.09 11.43,92.09 10.48,93.04 4.13,93.04 v3.49,93.67
  Bottom 0.152: IC36.7 33.34,88.91 v33.34,92.41 | v3.49,93.67 3.17,93.36 3.17,28.59 4.76,27 7.62,27 X1.B4
DATA14  (via drill 0.35)
  Top 0.152: IC36.8 35.24,86.37 31.11,86.37 30.16,87.33 30.16,91.45 12.06,91.45 v11.75,91.14
  Bottom 0.152: v11.75,91.14 11.43,91.45 11.43,92.09 10.48,93.04 3.49,93.04 3.49,30.81 4.76,29.54 7.62,29.54 X1.B5
DATA15  (via drill 0.35)
  Top 0.152: IC36.9 36.51,85.1 12.7,85.1 10.48,82.88 v4.45,82.88
  Bottom 0.152: v4.45,82.88 3.81,82.25 3.81,33.03 4.76,32.08 7.62,32.08 X1.B6
GND
  Top 0.152: X1.A32 X1.B32 X1.C32 10.48,97.17 19.68,97.17 20,96.85 20,93.04 C2.2 | 28.26,102.25 IC38.1 | 35.24,102.25 28.26,102.25 | IC38.5 35.24,102.25 | IC38.7 40.32,102.25 35.24,102.25 | IC38.8 44.45,105.74 C26.2 | C34.2 21.27,104.15 21.27,102.25 28.26,102.25 | IC36.10 48.9,87.96 52.7,91.77 57.15,91.77 C28.2 C9.2 | X1.A1 X1.B1 X1.C1 11.11,19.06 39.05,19.06 IC31.7 51.12,21.92 51.12,25.41 C36.2 | C32.2 53.34,62.56 IC37.10 40.32,64.15 32.07,64.15 30.48,65.73 15.88,65.73 C3.2 | JP2.39 JP2.40 | JP2.2 JP2.1 JP1.39 | IC21.8 163.83,63.83 JP1.39 | JP1.39 JP1.40 | JP1.2 JP1.1 | IC25.8 102.55,102.25 85.72,102.25 84.14,100.66 IC29.10 | C21.2 117.16,93.36 140.65,93.36 C27.2 | C17.2 117.16,67.96 136.53,67.96 136.84,68.27 140.34,68.27 C10.2 | C5.2 C24.2 C16.2 C15.2 | C22.2 C1.2 82.87,39.38 116.52,39.38 C13.2 | C11.2 C19.2 | C8.2 C37.2 | IC19.8 159.07,104.15 159.07,105.74 C25.2
  Bottom 0.152: C2.2 18.1,95.9 18.1,100.98 C34.2 | IC38.8 IC38.7 40.96,99.71 40.96,93.04 41.91,92.09 IC36.10 40.96,87.01 40.96,76.21 IC35.10 40.96,74.31 40.96,65.42 41.91,64.47 IC37.10 40.96,61.61 40.96,46.37 | C30.2 50.8,101.93 49.85,102.88 49.85,104.79 C26.2 | C3.2 14.29,67.32 14.29,79.39 C6.2 | IC31.7 40.96,22.87 40.96,33.67 | IC33.8 40.96,33.67 | 40.96,46.37 IC32.8 | 40.96,33.67 40.96,46.37 | 171.45,9.22 172.72,9.22 JP2.39 | 171.45,9.22 IC6.8 161.29,10.49 161.29,20.65 IC5.8 161.61,22.87 161.61,33.67 | 171.45,9.22 PWR.K | IC4.8 161.61,33.67 | 161.61,33.67 161.61,46.37 IC3.8 161.61,48.27 161.61,63.51 | 161.61,76.21 IC20.8 | 161.61,87.01 161.61,76.21 | IC18.8 161.61,87.01 | 161.61,87.01 161.61,99.71 IC19.8 162.56,101.93 JP1.1 | 161.61,63.51 IC21.8 | 161.61,76.21 161.61,63.51 | 80.01,21.92 IC16.10 | 80.01,21.92 80.01,24.78 81.28,26.05 C18.2 81.28,34.62 77.47,34.62 | 77.47,34.62 IC9.7 | 77.47,34.62 IC15.10 78.42,48.27 78.42,63.51 | C20.2 82.23,13.35 82.23,11.44 81.6,10.81 80.01,10.81 80.01,21.92 | 78.42,63.51 IC10.7 | 78.42,63.51 78.42,74.31 IC30.10 76.52,76.21 76.52,87.01 IC24.7 78.42,88.91 78.42,101.61 | C12.2 81.92,105.11 | 81.92,105.11 78.42,101.61 | 78.42,101.61 IC29.10 | IC22.10 136.84,99.71 136.84,88.91 IC17.7 134.94,87.01 134.94,76.21 IC23.10 134.94,74.31 134.94,63.51 IC2.7 136.84,61.61 136.84,46.37 | 136.84,22.87 IC8.10 | 136.84,33.67 136.84,22.87 | IC1.7 136.84,33.67 | 136.84,46.37 IC7.10 | 136.84,33.67 136.84,46.37 | 141.92,92.09 141.92,90.18 141.29,89.55 141.29,80.66 C33.2 141.6,79.7 141.6,78.44 141.92,78.12 141.92,66.69 | C27.2 141.92,92.09 | C25.2 141.92,104.79 141.92,92.09 | 141.92,15.25 C31.2
  Bottom 0.152: 141.92,26.05 141.92,15.25 | C37.2 141.92,26.05 | 141.92,38.75 C29.2 | 141.92,26.05 141.92,38.75 | 141.92,51.45 C35.2 | 141.92,38.75 141.92,51.45 | 141.92,66.69 C10.2 | 141.92,51.45 141.92,66.69 | 136.84,22.87 139.7,22.87 139.7,11.76 140.65,10.81 141.92,10.81 141.92,15.25 | IC26.8 103.19,87.01 103.19,76.21 IC27.8 103.19,74.31 103.19,68.91 104.14,67.96 IC28.8 105.09,61.61 105.09,46.37 | IC14.8 101.92,10.17 101.92,13.67 | 101.92,20.97 101.92,13.67 | IC13.8 101.92,20.97 | 101.92,20.97 101.92,32.4 IC12.8 105.09,35.57 105.09,46.37 | 105.09,46.37 IC11.8 | 101.92,13.67 105.73,17.47 105.73,23.51 C8.2 108.27,27.95 108.27,51.45 C15.2 | 21.27,40.65 C4.2 | 21.27,40.65 21.27,51.45 C5.2 | C38.2 21.27,28.59 21.27,40.65 | 83.5,51.45 C16.2 | 83.5,51.45 83.5,40.65 C1.2 | 83.5,66.69 C14.2 | 83.5,51.45 83.5,66.69 | 83.5,79.39 C11.2 | 83.5,66.69 83.5,79.39 | 83.5,92.09 C9.2 | 83.5,79.39 83.5,92.09 | C23.2 108.27,104.79 108.27,81.29 C19.2 | 81.92,105.11 83.5,103.52 83.5,92.09
IA-0  (via drill 0.35)
  Top 0.152: IC15.11 79.06,53.35 v92.39,53.35 92.71,53.03 v106.36,53.03 | v167,53.67 163.83,56.84 159.7,56.84 159.38,56.53 122.56,56.53 121.6,55.57 121.6,53.35 120.02,53.35 119.06,54.3 119.06,56.84 106.68,56.84 v106.36,56.53
  Bottom 0.152: v92.39,53.35 91.44,52.4 IC11.3 | v167,53.67 JP2.5 | v106.36,53.03 v106.36,56.53
IA-1  (via drill 0.35)
  Top 0.152: IC15.13 73.98,56.53 v87.95,56.53 | JP2.7 173.99,49.86 173.99,39.7 142.24,39.7 141.29,38.75 124.14,38.75 123.19,39.7 v120.97,39.7 | v87.31,31.76 v113.67,31.76
  Bottom 0.152: v87.95,56.53 87.95,48.27 IC11.2 87.63,46.05 87.63,32.08 v87.31,31.76 | v120.97,39.7 120.02,38.75 120.02,38.11 v113.67,31.76
IA-2  (via drill 0.35)
  Top 0.152: v98.42,57.16 v67.94,57.16 | JP2.9 169.86,51.45 169.86,58.43 125.73,58.43 125.41,58.75 122.24,58.75 121.92,58.43 100.65,58.43 v99.69,57.48
  Bottom 0.152: IC15.15 67.94,55.57 v67.94,57.16 | 99.69,57.16 100.01,57.16 100.01,48.27 IC11.6 | 99.69,57.16 v98.42,57.16 | 99.69,57.16 v99.69,57.48
IA-3  (via drill 0.35)
  Top 0.152: IC15.17 62.23,58.11 v98.42,58.11 | JP2.11 169.54,49.23 169.54,57.48 119.06,57.48 118.75,57.16 100.97,57.16 v100.65,57.48
  Bottom 0.152: v98.42,58.11 100.65,58.11 v100.65,57.48 100.65,48.27 IC11.7
IA-4
  Bottom 0.152: IC15.2 56.2,46.37 56.2,31.44 56.83,30.81 56.83,25.09 54.93,23.19 54.93,14.94 55.56,14.3 55.56,11.76 60.01,7.32 91.44,7.32 | IC12.3 91.44,7.32 | JP2.13 173.99,42.24 173.99,5.41 171.13,2.55 91.44,2.55 91.44,7.32
IA-5  (via drill 0.35)
  Top 0.152: v62.55,39.06 62.87,38.75 v88.9,38.75 89.22,39.06 101.92,39.06 102.23,38.75 117.16,38.75 118.75,40.34 129.54,40.34 129.86,40.65 172.4,40.65 JP2.15
  Bottom 0.152: IC15.4 62.55,47 v62.55,39.06 | IC12.2 v88.9,38.75
IA-6  (via drill 0.35)
  Top 0.152: IC15.6 68.9,48.91 83.82,48.91 84.45,49.54 v101.6,49.54 | v100.01,38.43 JP2.17
  Bottom 0.152: v101.6,49.54 102.55,48.59 102.55,45.41 100.01,42.88 v100.01,38.43 100.01,35.57 IC12.6
IA-7  (via drill 0.35)
  Top 0.152: v80.64,33.67 82.87,35.89 85.41,35.89 85.72,36.21 100.01,36.21 IC12.7 | JP2.19 170.5,38.11 105.09,38.11 v104.46,37.48
  Bottom 0.152: IC15.8 72.71,47 72.71,33.35 74.61,31.44 80.64,31.44 v80.64,33.67 | IC12.7 v104.46,37.48
IA-8  (via drill 0.35)
  Top 0.152: v79.69,25.41 v89.85,25.41 109.54,25.41 109.86,25.09 135.57,25.09 135.89,25.41 141.29,25.41 141.6,25.09 164.47,25.09 JP2.21
  Bottom 0.152: IC16.11 79.69,26.05 v79.69,25.41 | v89.85,25.41 90.17,25.09 IC13.3
IA-9  (via drill 0.35)
  Top 0.152: v84.77,26.05 72.71,26.05 v72.07,26.68 57.47,26.68 57.47,20.65 58.74,19.38 85.09,19.38 85.72,20.01 163.51,20.01 163.51,21.6 JP2.23
  Bottom 0.152: IC16.13 72.07,28.59 v72.07,26.68 | v84.77,26.05 87.63,23.19 IC13.2
IA-10  (via drill 0.35)
  Top 0.152: v68.9,13.03 v96.2,13.03 96.52,12.71 160.66,12.71 163.19,15.25 163.51,15.25 163.51,19.06 JP2.25
  Bottom 0.152: IC16.15 67.31,28.27 67.31,15.25 68.9,13.67 v68.9,13.03 | v96.2,13.03 98.74,15.57 98.74,20.97 IC13.6
IA-11  (via drill 0.35)
  Top 0.152: IC16.17 62.55,31.13 80.64,31.13 v83.19,28.59 | v83.19,27 83.5,26.68 v97.47,26.68 | v161.93,14.94 141.6,14.94 141.29,15.25 140.34,15.25 140.02,14.94 v100.01,14.94
  Bottom 0.152: v83.19,27 v83.19,28.59 | 99.38,24.78 100.33,23.82 IC13.7 | 99.38,24.78 v97.47,26.68 | JP2.27 163.51,16.52 163.51,15.57 162.88,14.94 v161.93,14.94 | v100.01,14.94 99.38,15.57 99.38,24.78
IA-12
  Top 0.152: JP2.29 167.64,18.11 167.64,7.63 91.76,7.63 IC14.3
  Bottom 0.152: IC16.2 55.88,12.08 60.33,7.63 90.17,7.63 IC14.3
IA-13  (via drill 0.35)
  Top 0.152: IC16.4 62.87,20.01 v84.77,20.01 | JP2.31 167.96,15.89 167.96,7.32 89.53,7.32 IC14.2
  Bottom 0.152: v84.77,20.01 86.68,18.11 86.68,10.17 IC14.2
IA-14  (via drill 0.35)
  Top 0.152: v66.04,12.08 66.67,11.44 80.33,11.44 80.96,10.81 83.82,10.81 84.77,11.76 v95.25,11.76 95.57,12.08 104.14,12.08 105.41,10.81 141.29,10.81 141.6,11.12 159.7,11.12 163.19,14.62 163.83,14.62 163.83,15.89 172.4,24.46 173.99,24.46 173.99,19.38 JP2.33
  Bottom 0.152: v66.04,12.08 IC16.6 | IC14.6 v95.25,11.76
IA-15  (via drill 0.35)
  Top 0.152: v79.38,8.27 80.96,6.68 v97.79,6.68 168.28,6.68 168.28,11.12 JP2.35
  Bottom 0.152: IC16.8 71.12,16.52 v79.38,8.27 | IC14.7 v97.79,6.68
IC-0  (via drill 0.35)
  Top 0.152: v84.77,106.06 85.72,105.11 v91.12,105.11 v94.93,105.11 | JP1.5 167.96,111.77 v131.44,111.77
  Bottom 0.152: IC29.11 84.77,108.28 v84.77,106.06 | v91.12,105.11 91.44,104.79 IC25.3 | v131.44,111.77 94.93,111.77 v94.93,105.11
IC-1
  Bottom 0.152: IC29.13 73.66,109.55 73.66,109.87 73.98,110.19 87.95,110.19 | 87.95,110.19 87.95,101.61 IC25.2 | JP1.7 173.99,105.74 173.99,112.41 173.04,113.36 87.95,113.36 87.95,110.19
IC-2  (via drill 0.35)
  Top 0.152: IC29.15 69.22,106.38 81.92,106.38 82.23,106.69 85.09,106.69 86.04,105.74 v98.74,105.74 99.69,104.79 109.54,104.79 111.12,106.38 136.84,106.38 137.16,106.69 141.29,106.69 141.6,106.38 159.38,106.38 v163.83,101.93
  Bottom 0.152: v98.74,105.74 99.06,105.42 IC25.6 | v163.83,101.93 JP1.9
IC-3  (via drill 0.35)
  Top 0.152: IC29.17 66.67,103.83 81.92,103.83 82.23,104.15 88.27,104.15 89.22,103.2 v100.97,103.2 | JP1.11 173.99,98.12 173.99,93.04 142.24,93.04 141.29,92.09 138.43,92.09 137.48,93.04 118.11,93.04 117.16,92.09 v105.41,92.09
  Bottom 0.152: v100.97,103.2 101.6,102.56 IC25.7 102.55,99.71 102.55,94.94 v105.41,92.09
IC-4  (via drill 0.35)
  Top 0.152: v63.82,110.5 64.45,111.14 v90.81,111.14 | JP1.13 163.19,106.38 v162.24,106.38
  Bottom 0.152: IC29.2 63.82,107.33 v63.82,110.5 | IC26.3 91.44,88.59 92.39,89.55 92.39,109.55 v90.81,111.14 90.81,113.04 159.38,113.04 160.97,111.45 160.97,107.64 v162.24,106.38
IC-5  (via drill 0.35)
  Top 0.152: v61.28,92.41 61.91,91.77 v86.36,91.77 98.74,91.77 99.69,92.72 111.76,92.72 113.03,93.99 117.16,93.99 117.47,93.67 129.54,93.67 129.86,93.99 172.4,93.99 JP1.15
  Bottom 0.152: IC29.4 61.28,99.71 v61.28,92.41 | v86.36,91.77 88.9,89.23 IC26.2
IC-6  (via drill 0.35)
  Top 0.152: v87.63,93.36 88.58,92.41 v98.42,92.41 | v167,97.48 121.92,97.48 121.6,97.8 101.28,97.8 v100.97,98.12
  Bottom 0.152: IC29.6 73.98,107.33 73.98,109.55 74.3,109.87 87.63,109.87 v87.63,93.36 | IC26.6 99.06,91.77 v98.42,92.41 100.01,93.99 100.01,97.17 v100.97,98.12 | v167,97.48 JP1.17
IC-7  (via drill 0.35)
  Top 0.152: v71.44,85.74 71.75,86.05 99.06,86.05 v99.38,85.74 v113.67,85.74 | JP1.19 170.5,91.45 123.83,91.45 123.19,90.82 v118.75,90.82
  Bottom 0.152: IC29.8 71.44,99.71 v71.44,85.74 | IC26.7 v99.38,85.74 | v113.67,85.74 v118.75,90.82
IC-8  (via drill 0.35)
  Top 0.152: v91.44,85.1 v79.69,85.1 | JP1.21 171.45,85.42 v117.47,85.42 | v115.89,87.01 113.35,89.55 v93.03,89.55
  Bottom 0.152: v79.69,85.1 IC30.11 | 92.39,84.15 v91.44,85.1 | 92.39,84.15 92.39,76.21 IC27.3 | v115.89,87.01 v117.47,85.42 | v93.03,89.55 92.39,88.91 92.39,84.15
IC-9  (via drill 0.35)
  Top 0.152: IC30.13 75.88,79.39 88.27,79.39 v88.58,79.7 98.74,79.7 99.06,79.39 110.17,79.39 110.17,82.25 112.39,84.47 124.14,84.47 124.14,82.25 125.09,81.29 134.3,81.29 134.3,83.52 135.25,84.47 172.4,84.47 JP1.23
  Bottom 0.152: v88.58,79.7 88.9,79.39 IC27.2
IC-10  (via drill 0.35)
  Top 0.152: v68.26,80.66 69.85,79.07 v98.42,79.07 | v165.42,63.2 160.97,58.75 126.05,58.75 125.73,59.07 121.92,59.07 121.6,58.75 105.73,58.75 v104.14,60.34
  Bottom 0.152: IC30.15 68.26,81.93 v68.26,80.66 | v98.42,79.07 99.06,78.44 IC27.6 100.01,74.31 100.01,69.55 102.55,67 102.55,61.92 v104.14,60.34 | JP1.25 165.42,74.31 v165.42,63.2
IC-11  (via drill 0.35)
  Top 0.152: IC30.17 63.82,84.47 99.69,84.47 100.65,83.52 100.65,80.97 v102.23,80.97 | JP1.27 167,73.36 v137.79,73.36 | v137.16,67.64 136.84,67.32 117.79,67.32 117.16,66.69 104.46,66.69 v103.19,67.96
  Bottom 0.152: v102.23,80.97 101.92,80.66 101.92,75.58 IC27.7 102.55,74.31 102.55,68.59 v103.19,67.96 | v137.79,73.36 137.16,72.72 v137.16,67.64
IC-12  (via drill 0.35)
  Top 0.152: v57.47,60.02 58.74,58.75 v90.81,58.75
  Bottom 0.152: IC30.2 57.47,74.94 v57.47,60.02 | v90.81,58.75 91.44,59.38 IC28.3
IC-13  (via drill 0.35)
  Top 0.152: IC30.4 63.82,73.67 73.34,73.67 74.61,72.4 v86.36,72.4 112.08,72.4 v112.39,72.72 | JP1.31 173.99,75.26 173.99,87.96 164.78,87.96 162.88,86.05 116.52,86.05 v115.89,85.42
  Bottom 0.152: v86.36,72.4 87.95,70.81 87.95,63.51 IC28.2 | v115.89,85.42 113.98,83.52 113.98,78.44 112.08,76.53 112.08,73.04 v112.39,72.72
IC-14  (via drill 0.35)
  Top 0.152: v68.58,67.64 69.85,66.37 v95.89,66.37 116.84,66.37 117.47,65.73 122.24,65.73 122.56,66.05 141.29,66.05 141.6,65.73 167,65.73 JP1.33
  Bottom 0.152: IC30.6 68.58,73.99 v68.58,67.64 | v95.89,66.37 99.06,63.2 IC28.6
IC-15  (via drill 0.35)
  Top 0.152: IC30.8 74.61,73.04 v95.89,73.04 96.2,73.36 134.62,73.36 135.25,72.72 173.99,72.72 173.99,70.18 JP1.35
  Bottom 0.152: v95.89,73.04 98.11,70.81 98.11,66.05 IC28.7
N$1  (via drill 0.35)
  Top 0.152: v25.72,58.75 v42.86,58.75
  Bottom 0.152: IC36.19 20.64,94.63 20.64,83.83 IC35.19 22.54,81.93 22.54,68.91 23.18,68.27 23.18,61.29 v25.72,58.75 | IC31.8 42.86,30.49 v42.86,58.75
N$2
  Bottom 0.152: IC26.4 93.66,88.28 93.66,93.67 93.03,94.31 93.03,107.33 IC25.13
N$3
  Bottom 0.152: IC26.5 95.57,88.91 95.57,107.33 IC25.12
N$4
  Bottom 0.152: IC27.4 94.93,76.21 94.93,94.63 IC26.13
N$5
  Bottom 0.152: IC27.5 97.47,76.21 97.47,94.63 IC26.12
N$6
  Bottom 0.152: IC28.4 93.03,63.51 93.03,81.93 IC27.13
N$7
  Bottom 0.152: IC28.5 95.25,63.83 95.25,81.61 IC27.12
N$8
  Top 0.152: IC24.8 79.06,97.17 97.47,97.17 IC26.11
  Bottom 0.152: IC25.11 98.11,107.33 98.11,96.53 IC26.11
N$9  (via drill 0.35)
  Top 0.152: v71.12,101.61 71.75,102.25 85.09,102.25 85.41,102.56 101.28,102.56 101.6,102.88 101.6,103.83 v97.16,103.83
  Bottom 0.152: IC24.3 71.12,91.77 v71.12,101.61 | v97.16,103.83 96.52,103.2 IC25.5
N$10
  Bottom 0.152: IC4.4 151.45,35.57 151.45,53.99 IC3.13
N$11
  Bottom 0.152: IC4.5 153.99,35.57 153.99,53.99 IC3.12
N$12
  Bottom 0.152: IC5.4 153.35,22.87 153.35,41.29 IC4.13
N$13
  Bottom 0.152: IC5.5 155.89,22.87 155.89,41.29 IC4.12
N$14
  Bottom 0.152: IC6.4 151.45,10.17 151.45,28.59 IC5.13
N$15
  Bottom 0.152: IC6.5 153.99,10.17 153.99,28.59 IC5.12
N$16
  Top 0.152: IC1.8 137.48,43.83 155.89,43.83 IC4.11
  Bottom 0.152: IC3.11 156.53,53.99 156.53,43.19 IC4.11
N$17  (via drill 0.35)
  Top 0.152: v128.27,32.08 128.59,32.4 v156.53,32.4
  Bottom 0.152: v128.27,32.08 IC1.3 | v156.53,32.4 156.21,32.71 156.21,46.05 IC3.5
N$18  (via drill 0.35)
  Top 0.152: v134.62,44.14 162.56,44.14 162.88,44.46 162.88,45.73 153.99,45.73 IC3.4
  Bottom 0.152: IC1.6 134.62,35.89 v134.62,44.14
N$19
  Bottom 0.152: IC31.3 31.11,21.28 31.11,15.89 30.8,15.57 30.16,15.57 25.4,20.33 25.4,46.05 IC32.1
N$20  (via drill 0.35)
  Top 0.152: v125.09,58.11 124.78,57.8 v118.43,57.8
  Bottom 0.152: IC7.1 113.98,48.27 113.98,53.35 IC7.19 v118.43,57.8 | IC2.3 125.09,61.92 v125.09,58.11
N$21  (via drill 0.35)
  Top 0.152: v133.03,59.7 132.72,59.38 v121.28,59.38
  Bottom 0.152: IC8.1 115.57,24.46 IC8.19 115.57,31.76 121.6,37.8 121.6,59.07 v121.28,59.38 | IC2.6 133.03,62.24 v133.03,59.7
N$22  (via drill 0.35)
  Top 0.152: v129.22,31.76 155.26,31.76 IC5.11
  Bottom 0.152: IC6.11 156.53,17.79 156.53,28.59 IC5.11 | IC1.11 129.22,41.29 v129.22,31.76
N$23  (via drill 0.35)
  Top 0.152: v93.66,98.12 v76.52,98.12
  Bottom 0.152: IC24.6 76.52,89.55 v76.52,98.12 | v93.66,98.12 93.98,98.44 IC25.4
N$24  (via drill 0.35)
  Top 0.152: IC31.6 37.47,23.82 v26.99,23.82
  Bottom 0.152: v26.99,23.82 25.72,25.09 25.72,53.99 IC32.15
N$25  (via drill 0.35)
  Top 0.152: v75.88,85.1 75.56,84.78 v55.56,84.78
  Bottom 0.152: IC10.8 75.88,71.77 v75.88,85.1 | v55.56,84.78 54.61,85.74 IC29.1 54.61,105.74 IC29.19
N$26  (via drill 0.35)
  Top 0.152: v69.53,72.4 68.58,73.36 56.52,73.36 IC30.1
  Bottom 0.152: IC30.1 57.15,77.8 IC30.19 | IC10.11 69.53,70.5 v69.53,72.4
N$27  (via drill 0.35)
  Top 0.152: v96.52,110.5 v66.36,110.5
  Bottom 0.152: IC28.11 98.42,70.81 98.42,73.67 97.79,74.31 97.79,81.61 | IC27.11 97.79,81.61 | IC24.11 66.36,99.07 v66.36,110.5 | v96.52,110.5 97.79,109.23 97.79,81.61
N$28
  Bottom 0.152: IC12.4 92.71,35.89 92.71,52.72 93.98,53.99 IC11.13
N$29
  Bottom 0.152: IC12.5 95.57,35.57 95.57,53.99 IC11.12
N$30
  Bottom 0.152: IC13.4 93.98,23.19 93.98,32.4 94.93,33.35 94.93,41.29 IC12.13
N$31
  Bottom 0.152: IC13.5 96.52,23.19 96.52,32.4 97.47,33.35 97.47,37.16 96.52,38.11 IC12.12
N$32
  Bottom 0.152: IC14.4 91.76,10.17 91.76,28.59 IC13.13
N$33
  Bottom 0.152: IC14.5 94.3,10.17 94.3,28.59 IC13.12
N$34  (via drill 0.35)
  Top 0.152: v76.83,44.46 77.15,44.14 97.79,44.14 v98.11,44.46
  Bottom 0.152: IC9.8 76.83,42.88 v76.83,44.46 | IC12.11 99.06,43.51 v98.11,44.46 98.11,53.99 IC11.11
N$35  (via drill 0.35)
  Top 0.152: v97.47,38.11 v66.99,38.11
  Bottom 0.152: IC9.3 66.99,35.57 v66.99,38.11 | v97.47,38.11 97.47,46.37 IC11.5
N$36  (via drill 0.35)
  Top 0.152: v74.3,44.46 74.93,45.1 87.95,45.1 88.58,44.46 92.71,44.46 v93.34,45.1
  Bottom 0.152: IC9.6 74.61,35.57 74.61,44.14 v74.3,44.46 | v93.34,45.1 93.98,45.73 IC11.4
N$37
  Bottom 0.152: IC31.11 33.02,28.27 33.02,12.08 32.38,11.44 30.16,11.44 30.16,14.94 25.08,20.01 25.08,39.06 22.86,41.29 22.86,67.96 21.59,69.23 IC37.19
N$38  (via drill 0.35)
  Top 0.152: v66.36,49.86 66.04,49.54 56.83,49.54 IC15.1
  Bottom 0.152: IC15.1 55.24,47.95 55.24,53.03 IC15.19 | IC10.3 66.99,62.24 66.99,56.84 66.36,56.21 v66.36,49.86
N$39  (via drill 0.35)
  Top 0.152: v58.1,50.49 v76.2,50.49
  Bottom 0.152: IC16.1 54.61,23.19 54.61,27.95 55.88,29.22 IC16.19 55.88,48.27 v58.1,50.49 | IC10.6 76.2,61.29 v76.2,50.49
N$40  (via drill 0.35)
  Top 0.152: IC9.11 70.48,40.34 81.92,40.34 82.23,40.65 85.09,40.65 85.72,40.02 v98.11,40.02
  Bottom 0.152: IC14.11 96.84,17.79 96.84,28.59 IC13.11 98.11,29.86 v98.11,40.02
N$41
  Bottom 0.152: IC31.9 40.64,28.27 40.64,20.97 41.27,20.33 43.18,20.33 43.18,58.11 44.13,59.07 44.13,109.23 43.5,109.87 33.34,109.87 33.34,101.61 IC38.4
N$42
  Top 0.152: IC31.12 33.34,27.95 35.24,27.95 IC31.10
  Bottom 0.152: IC38.11 40.32,102.25 40.32,93.04 40.01,92.72 40.01,89.55 40.32,89.23 40.32,50.49 37.78,47.95 37.78,30.49 IC31.10
N$43  (via drill 0.35)
  Top 0.152: v35.24,18.43 34.92,18.11 21.27,18.11 16.51,13.35 16.51,4.14 11.43,4.14 J1.3
  Bottom 0.152: IC32.5 35.24,46.37 v35.24,18.43
N$44
  Top 0.152: R1.1 155.89,5.09 173.04,5.09 PWR.A
N$46  (via drill 0.35)
  Top 0.152: IC32.6 32.7,43.19 32.7,40.65 v18.41,40.65
  Bottom 0.152: v18.41,40.65 14.61,36.84 14.61,6.68 13.97,6.04 13.97,4.14 J1.5
N$47
  Bottom 0.152: IC32.7 38.1,46.05 38.1,17.79 34.92,14.62 33.34,14.62 33.34,11.76 24.45,2.87 J1.7
N$48  (via drill 0.35)
  Top 0.152: IC32.11 39.05,57.16 v43.81,57.16
  Bottom 0.152: v43.81,57.16 44.45,57.8 44.45,109.55 43.18,110.82 10.16,110.82 J2.3
N$49  (via drill 0.35)
  Top 0.152: v34.92,59.38 34.29,60.02 v19.37,60.02
  Bottom 0.152: v34.92,59.38 IC32.10 | v19.37,60.02 16.51,62.88 16.51,87.96 12.7,91.77 J2.5
N$50  (via drill 0.35)
  Top 0.152: v43.18,109.23 42.55,109.87 15.56,109.87 J2.7
  Bottom 0.152: IC32.9 42.23,55.26 42.23,60.66 43.18,61.61 v43.18,109.23
N$58
  Bottom 0.152: IC19.4 IC18.13
N$59
  Bottom 0.152: IC19.5 IC18.12
N$60
  Bottom 0.152: IC20.4 153.35,76.21 153.35,107.33 IC19.13
N$61
  Bottom 0.152: IC20.5 155.89,76.21 155.89,107.33 IC19.12
N$62
  Bottom 0.152: IC21.4 151.45,63.51 151.45,81.93 IC20.13
N$63
  Bottom 0.152: IC21.5 153.99,63.51 153.99,81.93 IC20.12
N$64
  Top 0.152: IC17.8 137.48,97.17 155.89,97.17 IC18.11
  Bottom 0.152: IC19.11 156.53,107.33 156.53,96.53 IC18.11
N$65
  Top 0.152: IC17.3 127.32,86.37 153.35,86.37 IC18.5
N$66
  Top 0.152: IC17.6 134.94,89.55 150.81,89.55 IC18.4
N$80
  Bottom 0.152: IC18.3 148.59,89.23 148.59,109.23 147,110.82 136.53,110.82 136.53,108.91 IC22.11
N$81  (via drill 0.35)
  Top 0.152: v146.05,110.19 131.13,110.19 v130.81,110.5
  Bottom 0.152: IC18.2 146.05,89.23 v146.05,110.19 | IC22.13 v130.81,110.5
N$82  (via drill 0.35)
  Top 0.152: v128.91,105.11 129.54,104.47 v158.43,104.47
  Bottom 0.152: v128.91,105.11 IC22.15 | v158.43,104.47 158.43,88.91 IC18.6
N$83